# EAGLE design PiZeroGPSHat (EAGLE 7.3.0)
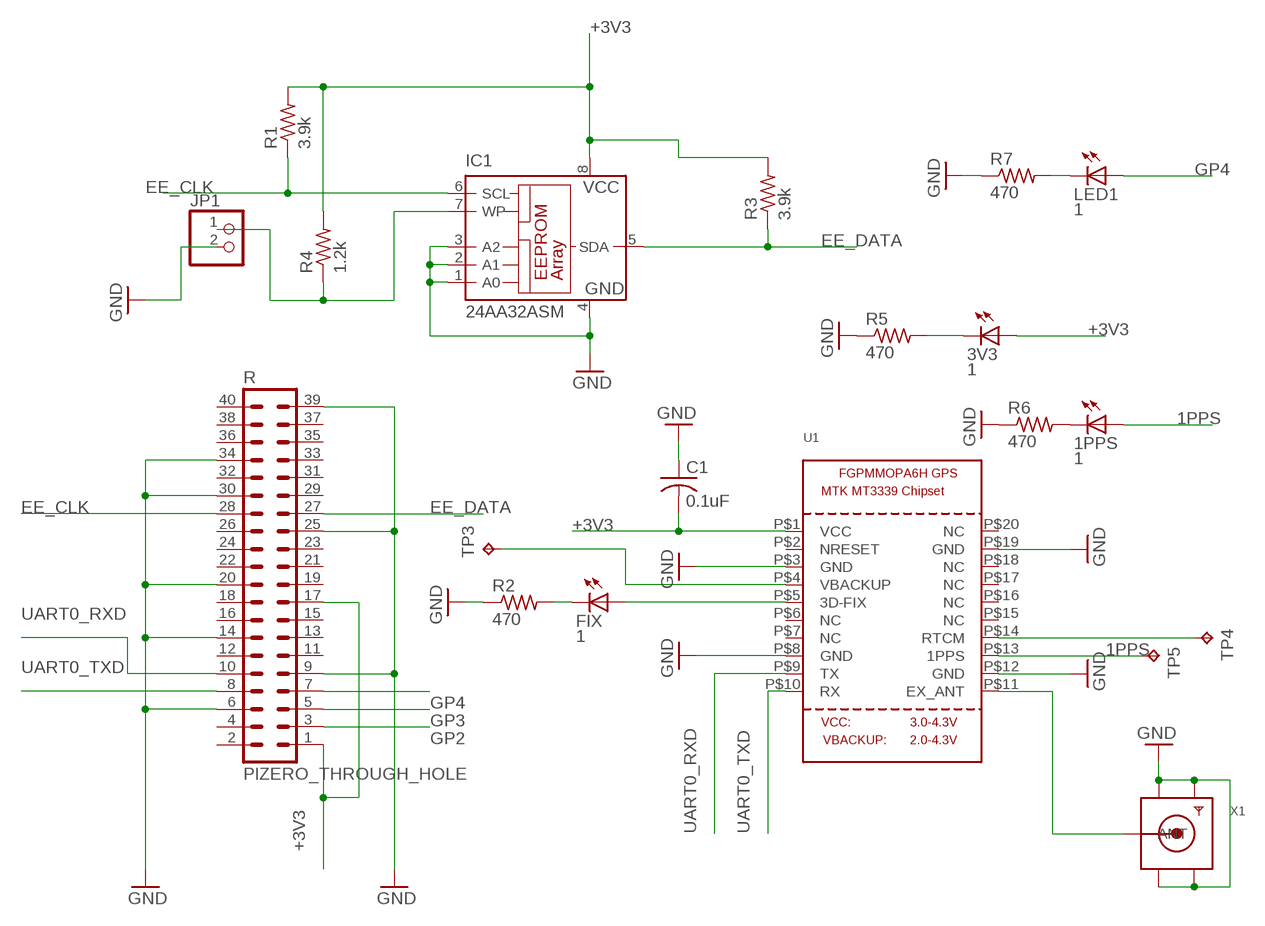
[diagram p0: schematic, sheet 1]

## Parts
1PPS  1  LEDCHIPLED_0805  [CHIPLED_0805]
3V3  1  LEDCHIPLED_0805  [CHIPLED_0805]
C1  0.1uF  C-USC0402  [C0402]
FIX  1  LEDCHIPLED_0805  [CHIPLED_0805]
IC1  24AA32ASM  [SO-08M]
JP1  PINHD-1X2  [1X02]
LED1  1  LEDCHIPLED_0805  [CHIPLED_0805]
R  PIZERO_THROUGH_HOLE  [PIZERO_THOUGH_HOLE]
R1  3.9k  R-US_R0402  [R0402]
R2  470  R-US_R0402  [R0402]
R3  3.9k  R-US_R0402  [R0402]
R4  1.2k  R-US_R0402  [R0402]
R5  470  R-US_R0402  [R0402]
R6  470  R-US_R0402  [R0402]
R7  470  R-US_R0402  [R0402]
TP3  TPB1,27  [B1,27]
TP4  TPB1,27  [B1,27]
TP5  TPB1,27  [B1,27]
U1  GPS_FGPMMOPA6H  [FGPMMOPA6H]
X1  SMACONNECTOR  [SMA90_DIP]

## Nets
1PPS: 1PPS.A TP5.TP U1.P$13(1PPS)
+3V3: 3V3.A C1.2 IC1.8(VCC) R1.2 R3.2 R4.2 R.1 R.17 U1.P$1(VCC)
EE_CLK: IC1.6(SCL) R1.1 R.28
EE_DATA: IC1.5(SDA) R3.1 R.27
GND: C1.1 IC1.1(A0) IC1.2(A1) IC1.3(A2) IC1.4(GND) JP1.2 R2.1 R5.1 R6.1 R7.1 R.6 R.9 R.14 R.20 R.25 R.30 R.34 R.39 U1.P$3(GND) U1.P$8(GND) U1.P$12(GND) U1.P$19(GND) X1.GND1 X1.GND2 X1.GND3 X1.GND4
GP2: R.3
GP3: R.5
GP4: LED1.A R.7
N$1: FIX.A U1.P$5(3D-FIX)
N$2: FIX.C R2.2
N$3: LED1.C R7.2
N$4: TP4.TP U1.P$14(RTCM)
N$5: TP3.TP U1.P$4(VBACKUP)
N$6: U1.P$11(EX_ANT) X1.ANTENNA(ANT)
N$7: 3V3.C R5.2
N$8: 1PPS.C R6.2
UART0_RXD: R.10 U1.P$9(TX)
UART0_TXD: R.8 U1.P$10(RX)
WP: IC1.7(WP) JP1.1 R4.1
Unconnected: R.2 R.4 R.11 R.12 R.13 R.15 R.16 R.18 R.19 R.21 R.22 R.23 R.24 R.26 R.29 R.31 R.32 R.33 R.35 R.36 R.37 R.38 R.40 U1.P$2(NRESET) U1.P$6(NC) U1.P$7(NC) U1.P$15(NC) U1.P$16(NC) U1.P$17(NC) U1.P$18(NC) U1.P$20(NC)

## Library data of the parts
1PPS 3V3 FIX LED1 = adafruit:LED: LED OSRAM: - CHIPLED LG R971, LG N971, LY N971, LG Q971, LY Q971, LO R971, LY R971 LH N974, LH R974 LS Q976, LO Q976, LY Q976 LO Q996 - Hyper CHIPLED LW Q18S LB Q993, LB Q99A, LB R99A - SideLED LS A670, LO A670, LY A670, LG A670, LP A670 LB A673, LV A673, LT A673, LW A673 LH A674 LY A675 LS A676, LA A676, LO A676, LY A676, LW A676 LS A679, LY A679, LG A679 - Hyper Micro SIDELED® LS Y876, LA Y876, LO Y876, LY Y876 LT Y87S - SmartLED LW L88C, LW L88S LB L89C, LB L89S, LG L890 LS L89K, LO L89K, LY L89K LS L896, LA L896, LO L896, LY L896 - TOPLED LS T670, LO T670, LY T670, LG T670, LP T670 LSG T670, LSP T670, LSY T670, LOP T670, LYG T670 LG T671, LOG T671, LSG T671 LB T673, LV T673, LT T673, LW T673 LH T674 LS T676, LA T676, LO T676, LY T676, LB T676, LH T676, LSB T676, LW T676 LB T67C, LV T67C, LT T67C, LS T67K, LO T67K, LY T67K, LW E67C LS E67B, LA E67B, LO E67B, LY E67B, LB E67C, LV E67C, LT E67C LW T67C LS T679, LY T679, LG T679 LS T770, LO T770, LY T770, LG T770, LP T770 LB T773, LV T773, LT T773, LW T773 LH T774 LS E675, LA E675, LY E675, LS T675 LS T776, LA T776, LO T776, LY T776, LB T776 LHGB T686 LT T68C, LB T68C - Hyper Mini TOPLED® LB M676 - Mini TOPLED Santana® LG M470 LS M47K, LO M47K, LY M47K Source: http://www.osram.convergy.de/
C1 = resistor:C-US: CAPACITOR, American symbol
IC1 = microchip:24*: Serial EEPROM I2C; MF: MICROCHIP; MPN: 24AA32A-I/SN; OC_FARNELL: 1617659; OC_NEWARK: 83C5815
JP1 = pinhead:PINHD-1X2: PIN HEADER
R = pizero:PIZERO_THROUGH_HOLE
R1-R7 = adafruit:R-US_: RESISTOR, American symbol
TP3-TP5 = testpad:TP: Test pad
U1 = adafruit:GPS_FGPMMOPA6H: GPS Module - MTK MT3339 Chipset, -165dBm sensitivity, 22 channels, 10Hz, auto-select external antenna options
X1 = adafruit:SMACONNECTOR: SMA Connector 90° DIP SMA Connector, 50 Ohm (4UConnector: 07259)

## Board
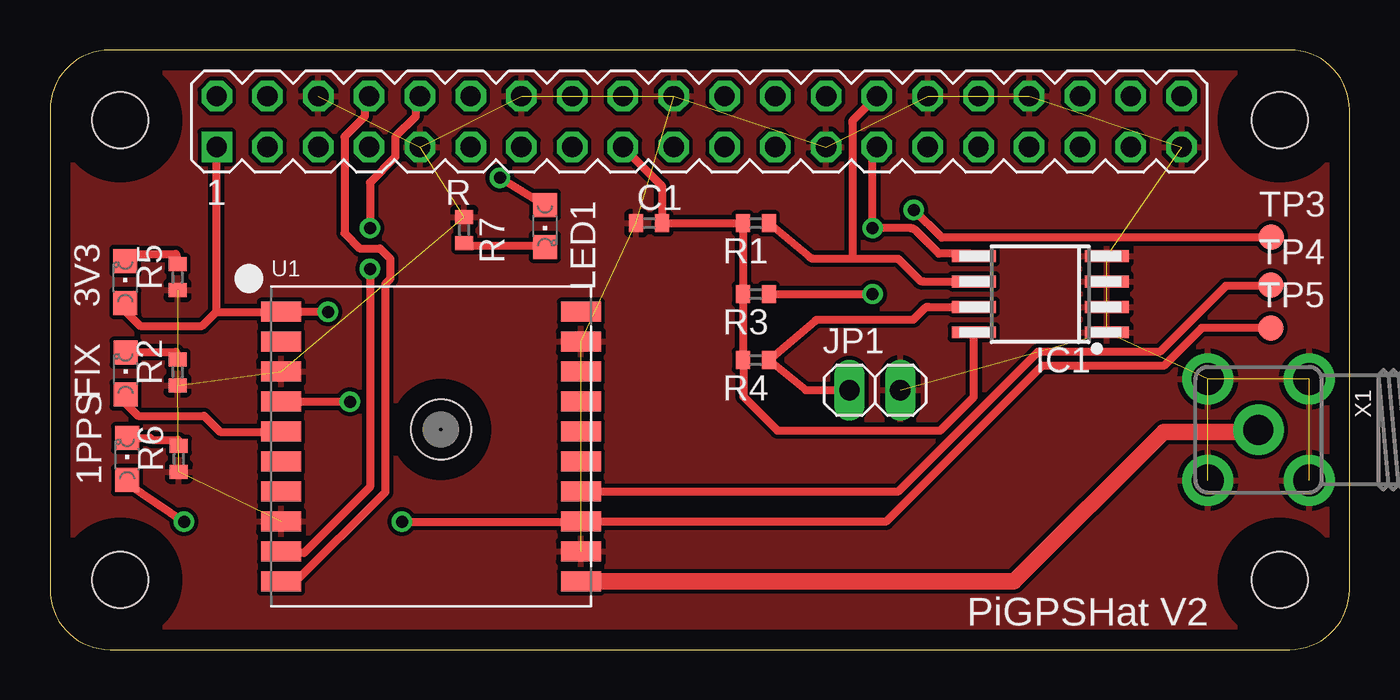
[diagram p1: board, top side]
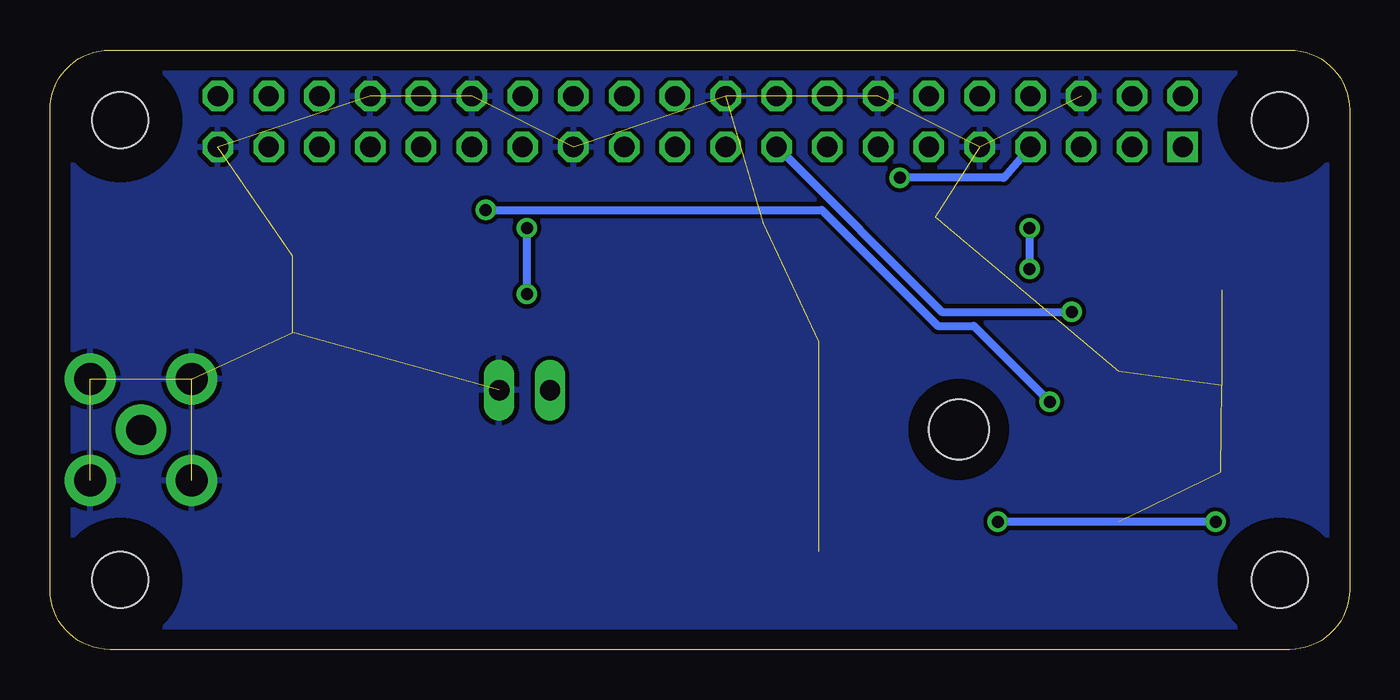
[diagram p2: board, bottom side, seen from below]

Size 65 x 30 mm. Coordinates in mm from the lower left corner, seen from the top.
Copper layers (1*16): Top 0.035mm / dielectric 1.5mm / Bottom 0.035mm
Design rules "default": minimum track width 10mil, minimum drill 24mil, track to track 8mil, track to pad 8mil, pad to pad 8mil, via to via 8mil, smd to smd 8mil, copper to edge 40mil, drill to drill 8mil, minimum pad ring 10mil, minimum via ring 8mil, stop-mask expansion 4mil, vias tented up to drill 0mil, thermal gap 10mil

### Footprints (pad centres in the part's own frame; a part is rotated, then mirrored left to right if it is on the bottom)
CHIPLED_0805 = smd 1.2 x 1.2: A 0,-1.05; C 0,1.05
C0402 = smd 0.7 x 0.9: 1 -0.65,0; 2 0.65,0
SO-08M = smd 0.6 x 2.2: 1 -1.905,-3.33; 2 -0.635,-3.33; 3 0.635,-3.33; 4 1.905,-3.33; 5 1.905,3.33; 6 0.635,3.33; 7 -0.635,3.33; 8 -1.905,3.33
1X02 = drill 1.016 long: 1 -1.27,0; 2 1.27,0
PIZERO_THOUGH_HOLE = drill 1.016 square: 1 8.34,25.15 | drill 1.016 octagon: 2 8.34,27.69; 3 10.88,25.15; 4 10.88,27.69; 5 13.42,25.15; 6 13.42,27.69; 7 15.96,25.15; 8 15.96,27.69; 9 18.5,25.15; 10 18.5,27.69; 11 21.04,25.15; 12 21.04,27.69; 13 23.58,25.15; 14 23.58,27.69; 15 26.12,25.15; 16 26.12,27.69; 17 28.66,25.15; 18 28.66,27.69; 19 31.2,25.15; 20 31.2,27.69; 21 33.74,25.15; 22 33.74,27.69; 23 36.28,25.15; 24 36.28,27.69; 25 38.82,25.15; 26 38.82,27.69; 27 41.36,25.15; 28 41.36,27.69; 29 43.9,25.15; 30 43.9,27.69; 31 46.44,25.15; 32 46.44,27.69; 33 48.98,25.15; 34 48.98,27.69; 35 51.52,25.15; 36 51.52,27.69; 37 54.06,25.15; 38 54.06,27.69; 39 56.6,25.15; 40 56.6,27.69 | hole 2.8: 3.5,3.5; 3.5,26.5; 61.5,26.5; 61.5,3.5
R0402 = smd 0.7 x 0.9: 1 -0.65,0; 2 0.65,0
B1,27 = smd 1.27 x 1.27: TP 0,0
FGPMMOPA6H = smd 2 x 1: P$1 -7.5,6.75; P$2 -7.5,5.25; P$3 -7.5,3.75; P$4 -7.5,2.25; P$5 -7.5,0.75; P$6 -7.5,-0.75; P$7 -7.5,-2.25; P$8 -7.5,-3.75; P$9 -7.5,-5.25; P$10 -7.5,-6.75; P$11 7.5,-6.75; P$12 7.5,-5.25; P$13 7.5,-3.75; P$14 7.5,-2.25; P$15 7.5,-0.75; P$16 7.5,0.75; P$17 7.5,2.25; P$18 7.5,3.75; P$19 7.5,5.25; P$20 7.5,6.75 | hole 3: 0.5,0.85
SMA90_DIP = drill 1.5 pad 2.54: ANTENNA 0,0 | drill 1.6 pad 2.54: GND1 -2.54,2.54; GND2 2.54,2.54; GND3 -2.54,-2.54; GND4 2.54,-2.54

### Placement (x,y rotation side)
1PPS  3.86,9.53 0 top
3V3  3.77,18.4 0 top
C1  29.97,21.34 0 top
FIX  3.78,13.81 0 top
IC1  49.53,17.78 90 top
JP1  41.26,12.98 0 top
LED1  24.76,21.2 180 top
R  0,0 0 top
R1  35.31,21.34 180 top
R2  6.38,13.87 90 top
R3  35.31,17.78 180 top
R4  35.31,14.48 180 top
R5  6.38,18.63 90 top
R6  6.44,9.54 90 top
R7  20.72,20.99 270 top
TP3  61.1,20.63 0 top
TP4  61.07,18.24 0 top
TP5  61.07,16.09 0 top
U1  19.05,10.16 0 top
X1  60.45,11 270 top

### Tracks (layer width: path | path; a pad name or v marks a point on that pad's centre or on a via)
1PPS  (via drill 0.6)
  Top 0.406: v17.6,6.4 26.4,6.4 U1.P$13 26.7,6.4 41.8,6.4 49.6,14.2 55.7,14.2 57.6,16.1 61,16.1 TP5.TP | v6.7,6.4 3.9,8.3 1PPS.A
  Bottom 0.406: v6.7,6.4 v17.6,6.4
+3V3  (via drill 0.6)
  Top 0.406: R.17 30.55,23.26 arc-45 30.62,23.08 C1.2 R1.2 R3.2 R4.2 34.68,14.3 34.68,12.66 36.38,10.96 44.53,10.96 46.2,12.63 IC1.8 | 8.3,16.9 11.4,16.9 U1.P$1 11.7,16.9 v13.9,16.9 | 8.3,16.9 7.6,16.2 4.5,16.2 3.7,17 3V3.A | 8.3,16.9 8.3,25.1 R.1
  Bottom 0.406: v13.9,16.9 20.4,16.9 28.6,25.1 R.17
EE_CLK
  Top 0.406: R1.1 38.01,19.63 arc45 38.19,19.56 40.13,19.56 | 40.13,19.56 42.42,19.56 43.49,18.49 arc45 43.67,18.41 IC1.6 | R.28 40.21,26.54 arc45 40.13,26.36 40.13,19.56
EE_DATA  (via drill 0.6)
  Top 0.406: R3.1 v41.15,17.78 | R.27 41.15,24.64 v41.15,21.08 43.08,21.08 arc-45 43.25,21.01 44.45,19.81 45.97,19.81 arc-45 46.15,19.74 IC1.5
  Bottom 0.406: v41.15,17.78 v41.15,21.08
GND  (25 unrouted)
  pour Bottom (rank 6): 0.51,27.18 2.79,29.46 6.86,29.72 62.23,29.72 64.52,27.43 64.52,2.29 62.74,0.51 3.3,0.51 2.03,1.02 0.51,3.05
  pour Top (rank 6): 0.51,27.26 2.79,29.54 6.86,29.8 62.23,29.8 64.52,27.51 64.52,2.37 62.74,0.59 3.3,0.59 2.03,1.1 0.51,3.13
GP4  (via drill 0.6)
  Top 0.406: v22.5,23.6 LED1.A
  Bottom 0.406: v22.5,23.6 17.3,23.6 16,25.1 R.7
N$1
  Top 0.406: U1.P$5 11.5,10.9 8.5,10.9 7.7,11.7 4.4,11.7 3.6,12.5 FIX.A
N$2
  Top 0.406: R2.2 6.3,14.9 3.8,14.9 FIX.C
N$3
  Top 0.406: R7.2 20.8,20.2 24.7,20.2 LED1.C
N$4
  Top 0.406: 26.64,7.87 arc-45 U1.P$14 26.8,7.9 42.4,7.9 49.4,14.9 55.5,14.9 58.8,18.2 61,18.2 TP4.TP
N$5  (via drill 0.6)
  Top 0.406: v15,12.4 11.6,12.4 U1.P$4 | v43.2,22 44.6,20.6 60.8,20.6 61,20.5 TP3.TP
  Bottom 0.406: v15,12.4 18.8,16.2 20.6,16.2 26.4,22 v43.2,22
N$6
  Top 0.813: U1.P$11 48.21,3.41 55.7,10.9 60.35,10.9 X1.ANTENNA
N$7
  Top 0.406: R5.2 6.3,19.8 3.8,19.8 3V3.C
N$8
  Top 0.406: R6.2 6.4,10.5 5.1,10.5 5,10.6 3.9,10.6 1PPS.C
UART0_RXD  (via drill 0.6)
  Top 0.406: v16,19.05 16,8.13 12.7,4.83 11.68,4.83 U1.P$9 | v16,21.08 16,23.37 17.27,24.64 17.27,25.65 18.29,26.67 18.29,27.69 R.10
  Bottom 0.406: v16,21.08 v16,19.05
UART0_TXD
  Top 0.406: U1.P$10 11.68,3.3 12.19,3.3 16.76,7.87 16.76,18.29 17.02,18.54 17.02,19.56 16.51,20.07 15.49,20.07 14.73,20.83 14.73,25.65 15.75,26.67 15.75,27.69 R.8
WP
  Top 0.406: IC1.7 43.92,17.14 arc45 43.74,17.07 43.18,16.51 38.44,16.51 arc45 38.26,16.44 R4.1 37.8,12.98 JP1.1

### Text on the board
tNames: PiGPSHat V2